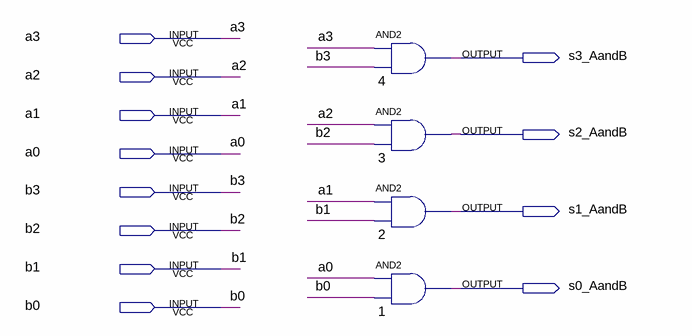
[diagram p0: schematic sheet]
// Quartus schematic AandB.bdf as structural Verilog: 4 symbols, 12 pins
module AandB (
  input  a3,
  input  a2,
  input  a1,
  input  a0,
  input  b3,
  input  b2,
  input  b1,
  input  b0,
  output s3_AandB,
  output s2_AandB,
  output s1_AandB,
  output s0_AandB
);

  and u_4 (s3_AandB, a3, b3);
  and u_3 (s2_AandB, a2, b2);
  and u_2 (s1_AandB, a1, b1);
  and u_1 (s0_AandB, a0, b0);
endmodule
